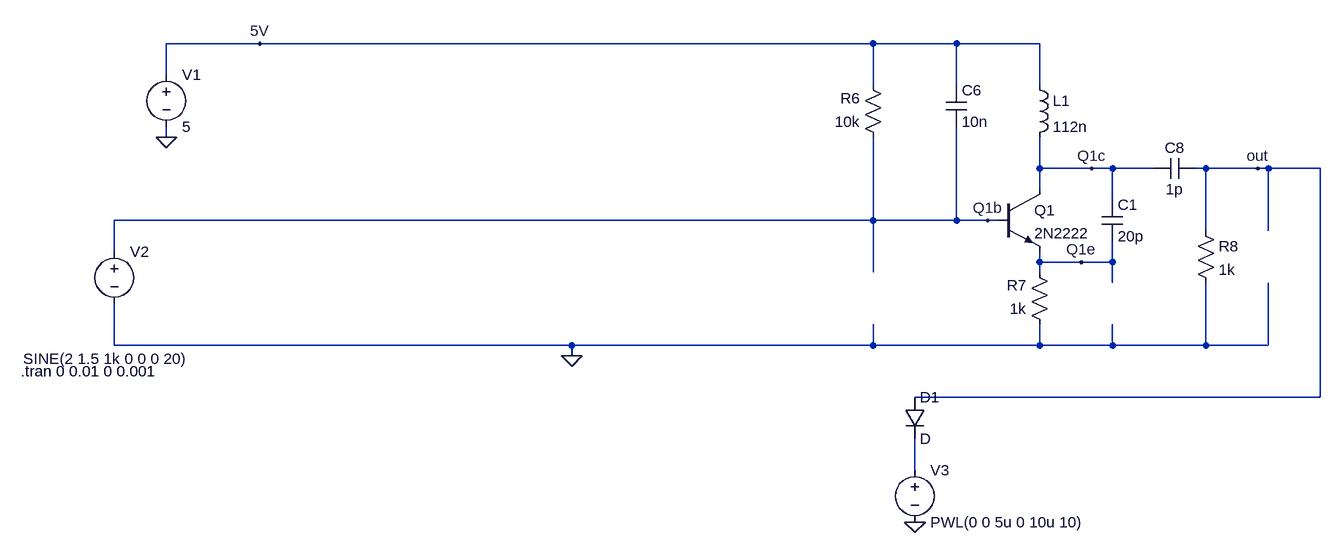
[diagram p0: schematic FM_transmitter_2.asc]
FM_transmitter_2.asc, the LTspice schematic file:
Version 4
SHEET 1 1672 680
WIRE -16 -144 -160 -144
WIRE 928 -144 -16 -144
WIRE 1056 -144 928 -144
WIRE 1184 -144 1056 -144
WIRE -160 -96 -160 -144
WIRE 928 -80 928 -144
WIRE 1056 -80 1056 -144
WIRE 1184 -80 1184 -144
WIRE -160 0 -160 -16
WIRE 1184 48 1184 0
WIRE 1264 48 1184 48
WIRE 1296 48 1264 48
WIRE 1360 48 1296 48
WIRE 1440 48 1424 48
WIRE 1520 48 1440 48
WIRE 1536 48 1520 48
WIRE 1616 48 1536 48
WIRE 1184 80 1184 48
WIRE 1296 96 1296 48
WIRE 928 128 928 0
WIRE 928 128 -240 128
WIRE 1056 128 1056 -16
WIRE 1056 128 928 128
WIRE 1104 128 1056 128
WIRE 1120 128 1104 128
WIRE 1440 144 1440 48
WIRE 1536 144 1536 48
WIRE -240 176 -240 128
WIRE 1184 192 1184 176
WIRE 1248 192 1184 192
WIRE 1296 192 1296 160
WIRE 1296 192 1248 192
WIRE 928 208 928 128
WIRE 1184 208 1184 192
WIRE 1296 224 1296 192
WIRE -240 320 -240 256
WIRE 464 320 -240 320
WIRE 928 320 928 288
WIRE 928 320 464 320
WIRE 1184 320 1184 288
WIRE 1184 320 928 320
WIRE 1296 320 1296 288
WIRE 1296 320 1184 320
WIRE 1440 320 1440 224
WIRE 1440 320 1296 320
WIRE 1536 320 1536 224
WIRE 1536 320 1440 320
WIRE 464 336 464 320
WIRE 1616 400 1616 48
WIRE 1616 400 992 400
WIRE 992 512 992 464
FLAG 464 336 0
FLAG -16 -144 5V
FLAG -160 0 0
FLAG 1264 48 Q1c
FLAG 1520 48 out
FLAG 1104 128 Q1b
FLAG 1248 192 Q1e
FLAG 992 592 0
SYMBOL res 944 16 R180
WINDOW 0 36 76 Left 2
WINDOW 3 36 40 Left 2
SYMATTR InstName R6
SYMATTR Value 10k
SYMBOL res 1200 304 R180
WINDOW 0 36 76 Left 2
WINDOW 3 36 40 Left 2
SYMATTR InstName R7
SYMATTR Value 1k
SYMBOL cap 1040 -80 R0
SYMATTR InstName C6
SYMATTR Value 10n
SYMBOL cap 1424 32 R90
WINDOW 0 0 32 VBottom 2
WINDOW 3 32 32 VTop 2
SYMATTR InstName C8
SYMATTR Value 1p
SYMBOL ind 1168 -96 R0
SYMATTR InstName L1
SYMATTR Value 112n
SYMBOL res 1424 128 R0
SYMATTR InstName R8
SYMATTR Value 1k
SYMBOL voltage -160 -112 R0
WINDOW 123 0 0 Left 0
WINDOW 39 0 0 Left 0
SYMATTR InstName V1
SYMATTR Value 5
SYMBOL voltage -240 160 R0
WINDOW 3 -140 181 Left 2
WINDOW 123 0 0 Left 0
WINDOW 39 0 0 Left 0
SYMATTR Value SINE(2 1.5 1k 0 0 0 20)
SYMATTR InstName V2
SYMBOL cap 1280 96 R0
SYMATTR InstName C1
SYMATTR Value 20p
SYMBOL npn 1120 80 R0
SYMATTR InstName Q1
SYMATTR Value 2N2222
SYMBOL diode 976 400 R0
SYMATTR InstName D1
SYMBOL voltage 992 496 R0
WINDOW 123 0 0 Left 0
WINDOW 39 0 0 Left 0
SYMATTR InstName V3
SYMATTR Value PWL(0 0 5u 0 10u 10)
TEXT -384 360 Left 2 !.tran 0 0.01 0 0.001

The netlist it stands for:
* FM_transmitter_2.asc
R6 Q1b 5V 10k
R7 0 Q1e 1k
C6 5V Q1b 10n
C8 out Q1c 1p
L1 5V Q1c 112n
R8 out 0 1k
V1 5V 0 5
V2 Q1b 0 SINE(2 1.5 1k 0 0 0 20)
C1 Q1c Q1e 20p
Q1 Q1c Q1b Q1e 0 2N2222
D1 out N001 D
V3 N001 0 PWL(0 0 5u 0 10u 10)
.model D D
.lib standard.dio
.model NPN NPN
.model PNP PNP
.lib standard.bjt
.tran 0 0.01 0 0.001
.backanno
.end